# EAGLE schematic EPS FV1 (EAGLE 7.2.0)
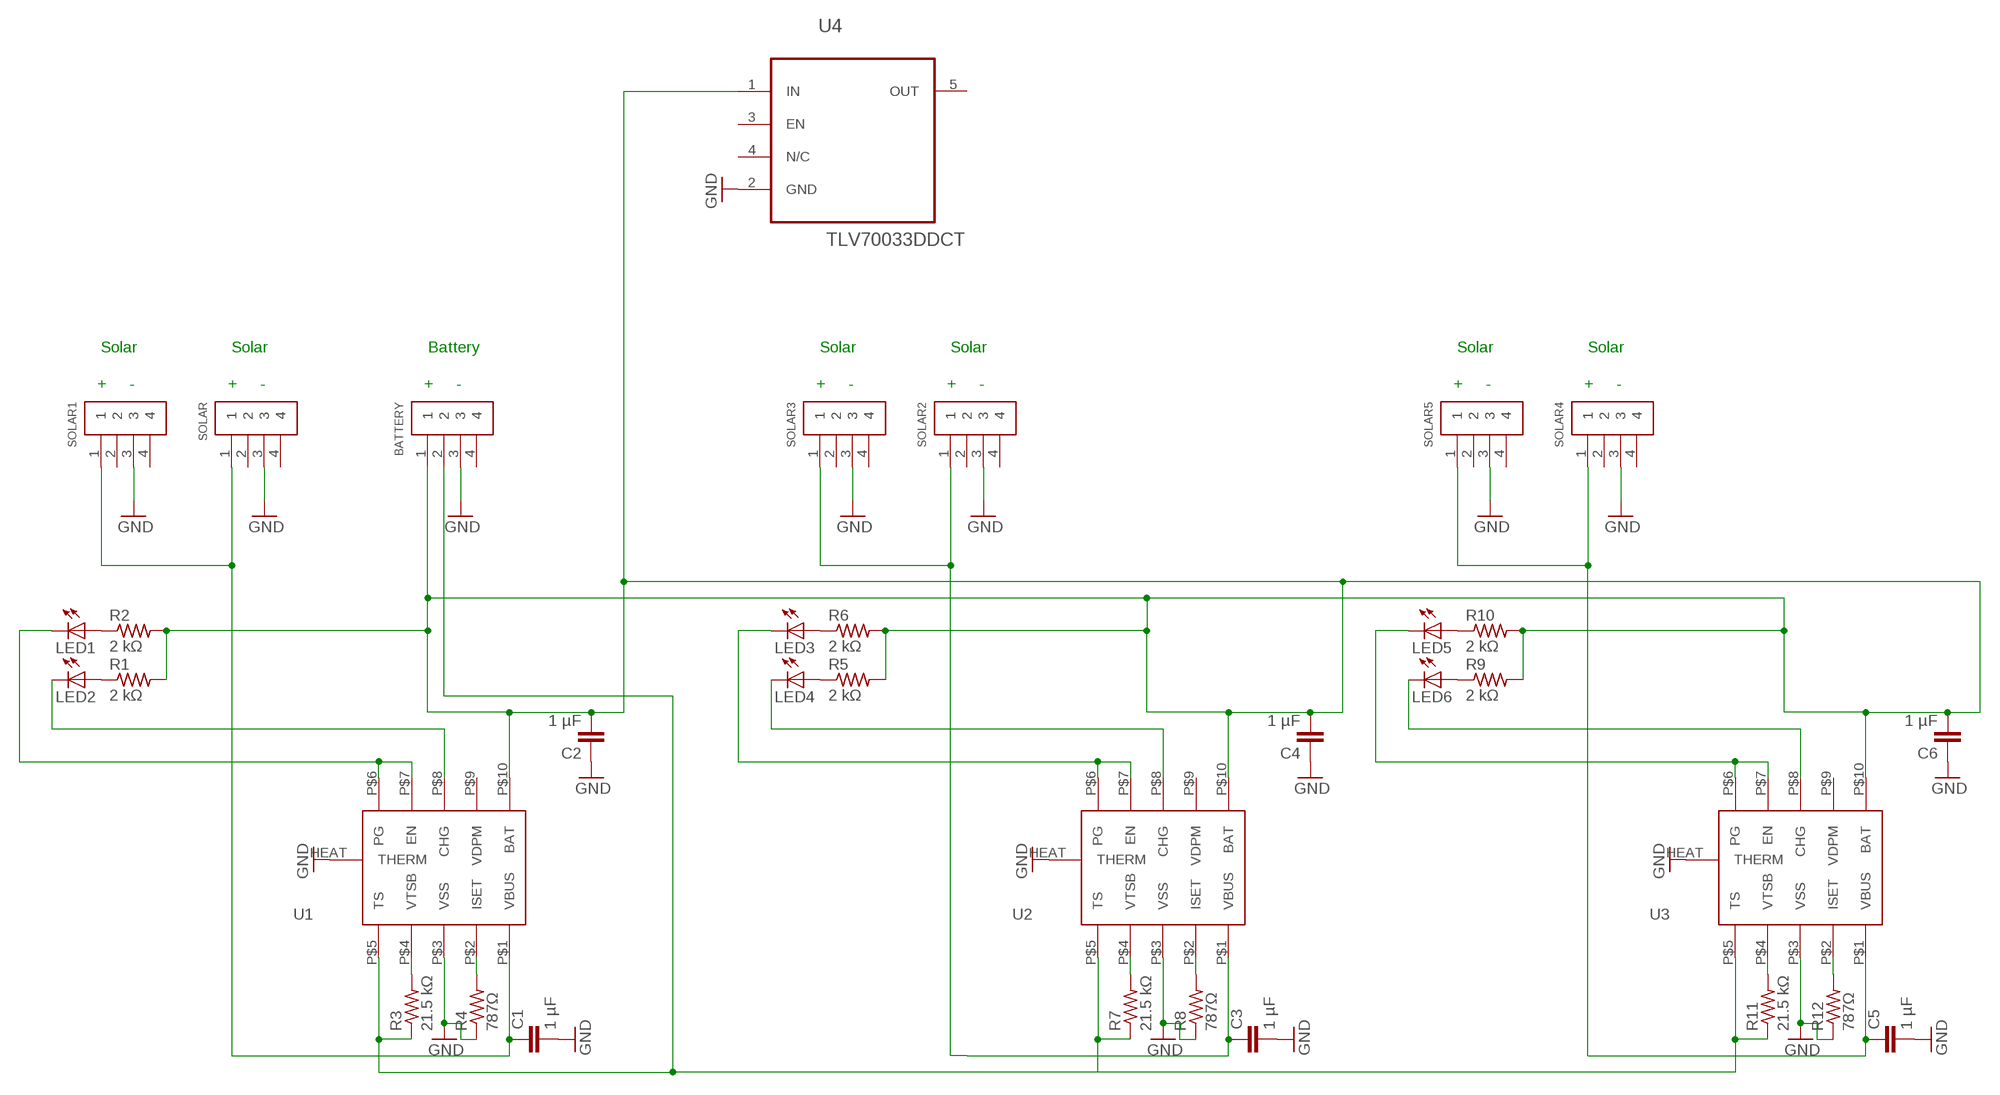
[diagram p0: schematic, sheet 1]

## Parts
BATTERY  1X4-CLEANBIG  [1X04-CLEANBIG]
C1  1 µF  C-EUC0805  [C0805]
C2  1 µF  C-EUC0805  [C0805]
C3  1 µF  C-EUC0805  [C0805]
C4  1 µF  C-EUC0805  [C0805]
C5  1 µF  C-EUC0805  [C0805]
C6  1 µF  C-EUC0805  [C0805]
LED1  LEDCHIP-LED0805  [CHIP-LED0805]
LED2  LEDCHIP-LED0805  [CHIP-LED0805]
LED3  LEDCHIP-LED0805  [CHIP-LED0805]
LED4  LEDCHIP-LED0805  [CHIP-LED0805]
LED5  LEDCHIP-LED0805  [CHIP-LED0805]
LED6  LEDCHIP-LED0805  [CHIP-LED0805]
R1  2 kΩ  R-US_R0805  [R0805]
R2  2 kΩ  R-US_R0805  [R0805]
R3  21.5 kΩ  R-US_R0805  [R0805]
R4  787Ω  R-US_R0805  [R0805]
R5  2 kΩ  R-US_R0805  [R0805]
R6  2 kΩ  R-US_R0805  [R0805]
R7  21.5 kΩ  R-US_R0805  [R0805]
R8  787Ω  R-US_R0805  [R0805]
R9  2 kΩ  R-US_R0805  [R0805]
R10  2 kΩ  R-US_R0805  [R0805]
R11  21.5 kΩ  R-US_R0805  [R0805]
R12  787Ω  R-US_R0805  [R0805]
SOLAR  1X4-CLEANBIG  [1X04-CLEANBIG]
SOLAR1  1X4-CLEANBIG  [1X04-CLEANBIG]
SOLAR2  1X4-CLEANBIG  [1X04-CLEANBIG]
SOLAR3  1X4-CLEANBIG  [1X04-CLEANBIG]
SOLAR4  1X4-CLEANBIG  [1X04-CLEANBIG]
SOLAR5  1X4-CLEANBIG  [1X04-CLEANBIG]
U1  BQ24210  [BQ24210]
U2  BQ24210  [BQ24210]
U3  BQ24210  [BQ24210]
U4  TLV70033DDCT  [SOT95P280X110-5N]

## Nets
GND: BATTERY.3 C1.2 C2.1 C3.2 C4.1 C5.2 C6.1 R4.1 R8.1 R12.1 SOLAR1.3 SOLAR2.3 SOLAR3.3 SOLAR4.3 SOLAR5.3 SOLAR.3 U1.HEAT(THERM) U1.P$3(VSS) U2.HEAT(THERM) U2.P$3(VSS) U3.HEAT(THERM) U3.P$3(VSS) U4.2(GND)
N$1: LED1.C U1.P$6(PG) U1.P$7(EN)
N$3: LED5.C U3.P$6(PG) U3.P$7(EN)
N$4: C1.1 SOLAR1.1 SOLAR.1 U1.P$1(VBUS)
N$5: LED1.A R2.1
N$6: LED2.A R1.1
N$7: R3.2 U1.P$4(VTSB)
N$8: R4.2 U1.P$2(ISET)
N$9: LED2.C U1.P$8(CHG)
N$10: LED3.C U2.P$6(PG) U2.P$7(EN)
N$13: C3.1 SOLAR2.1 SOLAR3.1 U2.P$1(VBUS)
N$14: R7.2 U2.P$4(VTSB)
N$15: R8.2 U2.P$2(ISET)
N$16: LED3.A R6.1
N$17: LED4.A R5.1
N$18: LED4.C U2.P$8(CHG)
N$19: C5.1 SOLAR4.1 SOLAR5.1 U3.P$1(VBUS)
N$20: R11.2 U3.P$4(VTSB)
N$21: R12.2 U3.P$2(ISET)
N$22: LED5.A R10.1
N$23: LED6.A R9.1
N$24: LED6.C U3.P$8(CHG)
N$25: BATTERY.2 R3.1 R7.1 R11.1 U1.P$5(TS) U2.P$5(TS) U3.P$5(TS)
N$26: BATTERY.1 C2.2 C4.2 C6.2 R1.2 R2.2 R5.2 R6.2 R9.2 R10.2 U1.P$10(BAT) U2.P$10(BAT) U3.P$10(BAT) U4.1(IN)
Unconnected: BATTERY.4 SOLAR1.2 SOLAR1.4 SOLAR2.2 SOLAR2.4 SOLAR3.2 SOLAR3.4 SOLAR4.2 SOLAR4.4 SOLAR5.2 SOLAR5.4 SOLAR.2 SOLAR.4 U1.P$9(VDPM) U2.P$9(VDPM) U3.P$9(VDPM) U4.3(EN) U4.4(N/C) U4.5(OUT)

## Notes on the sheet
- Solar | Solar | Battery | Solar | Solar | Solar | Solar
- + | - | + | - | + | - | + | - | + | - | + | - | + | -

## Library data of the parts
BATTERY SOLAR SOLAR1-SOLAR5 = adafruit:1X4: 4-pin connector
C1-C6 = rcl:C-EU: CAPACITOR, European symbol
LED1-LED6 = adafruit:LED: LED OSRAM: - CHIPLED LG R971, LG N971, LY N971, LG Q971, LY Q971, LO R971, LY R971 LH N974, LH R974 LS Q976, LO Q976, LY Q976 LO Q996 - Hyper CHIPLED LW Q18S LB Q993, LB Q99A, LB R99A - SideLED LS A670, LO A670, LY A670, LG A670, LP A670 LB A673, LV A673, LT A673, LW A673 LH A674 LY A675 LS A676, LA A676, LO A676, LY A676, LW A676 LS A679, LY A679, LG A679 - Hyper Micro SIDELED® LS Y876, LA Y876, LO Y876, LY Y876 LT Y87S - SmartLED LW L88C, LW L88S LB L89C, LB L89S, LG L890 LS L89K, LO L89K, LY L89K LS L896, LA L896, LO L896, LY L896 - TOPLED LS T670, LO T670, LY T670, LG T670, LP T670 LSG T670, LSP T670, LSY T670, LOP T670, LYG T670 LG T671, LOG T671, LSG T671 LB T673, LV T673, LT T673, LW T673 LH T674 LS T676, LA T676, LO T676, LY T676, LB T676, LH T676, LSB T676, LW T676 LB T67C, LV T67C, LT T67C, LS T67K, LO T67K, LY T67K, LW E67C LS E67B, LA E67B, LO E67B, LY E67B, LB E67C, LV E67C, LT E67C LW T67C LS T679, LY T679, LG T679 LS T770, LO T770, LY T770, LG T770, LP T770 LB T773, LV T773, LT T773, LW T773 LH T774 LS E675, LA E675, LY E675, LS T675 LS T776, LA T776, LO T776, LY T776, LB T776 LHGB T686 LT T68C, LB T68C - Hyper Mini TOPLED® LB M676 - Mini TOPLED Santana® LG M470 LS M47K, LO M47K, LY M47K Source: http://www.osram.convergy.de/
R1-R12 = adafruit:R-US_: RESISTOR, American symbol
U1-U3 = satellite:BQ24210: Texas Instruments Solar Li-Ion Battery Charger Input Voltage: 3.5V - 18V Output Voltage: 4.2V @ 800mAh
U4 = TLV70033DDCT:TLV70033DDCT: 200-mA, Low-IQ, Low-Dropout Regulator for Portable Devices; MPN: TLV70033DDCT; OC_FARNELL: 1778230; OC_NEWARK: 50R4446; PACKAGE: TSOT-23-5; SUPPLIER: Texas Instruments